# Altium project LM-003.PrjPcb
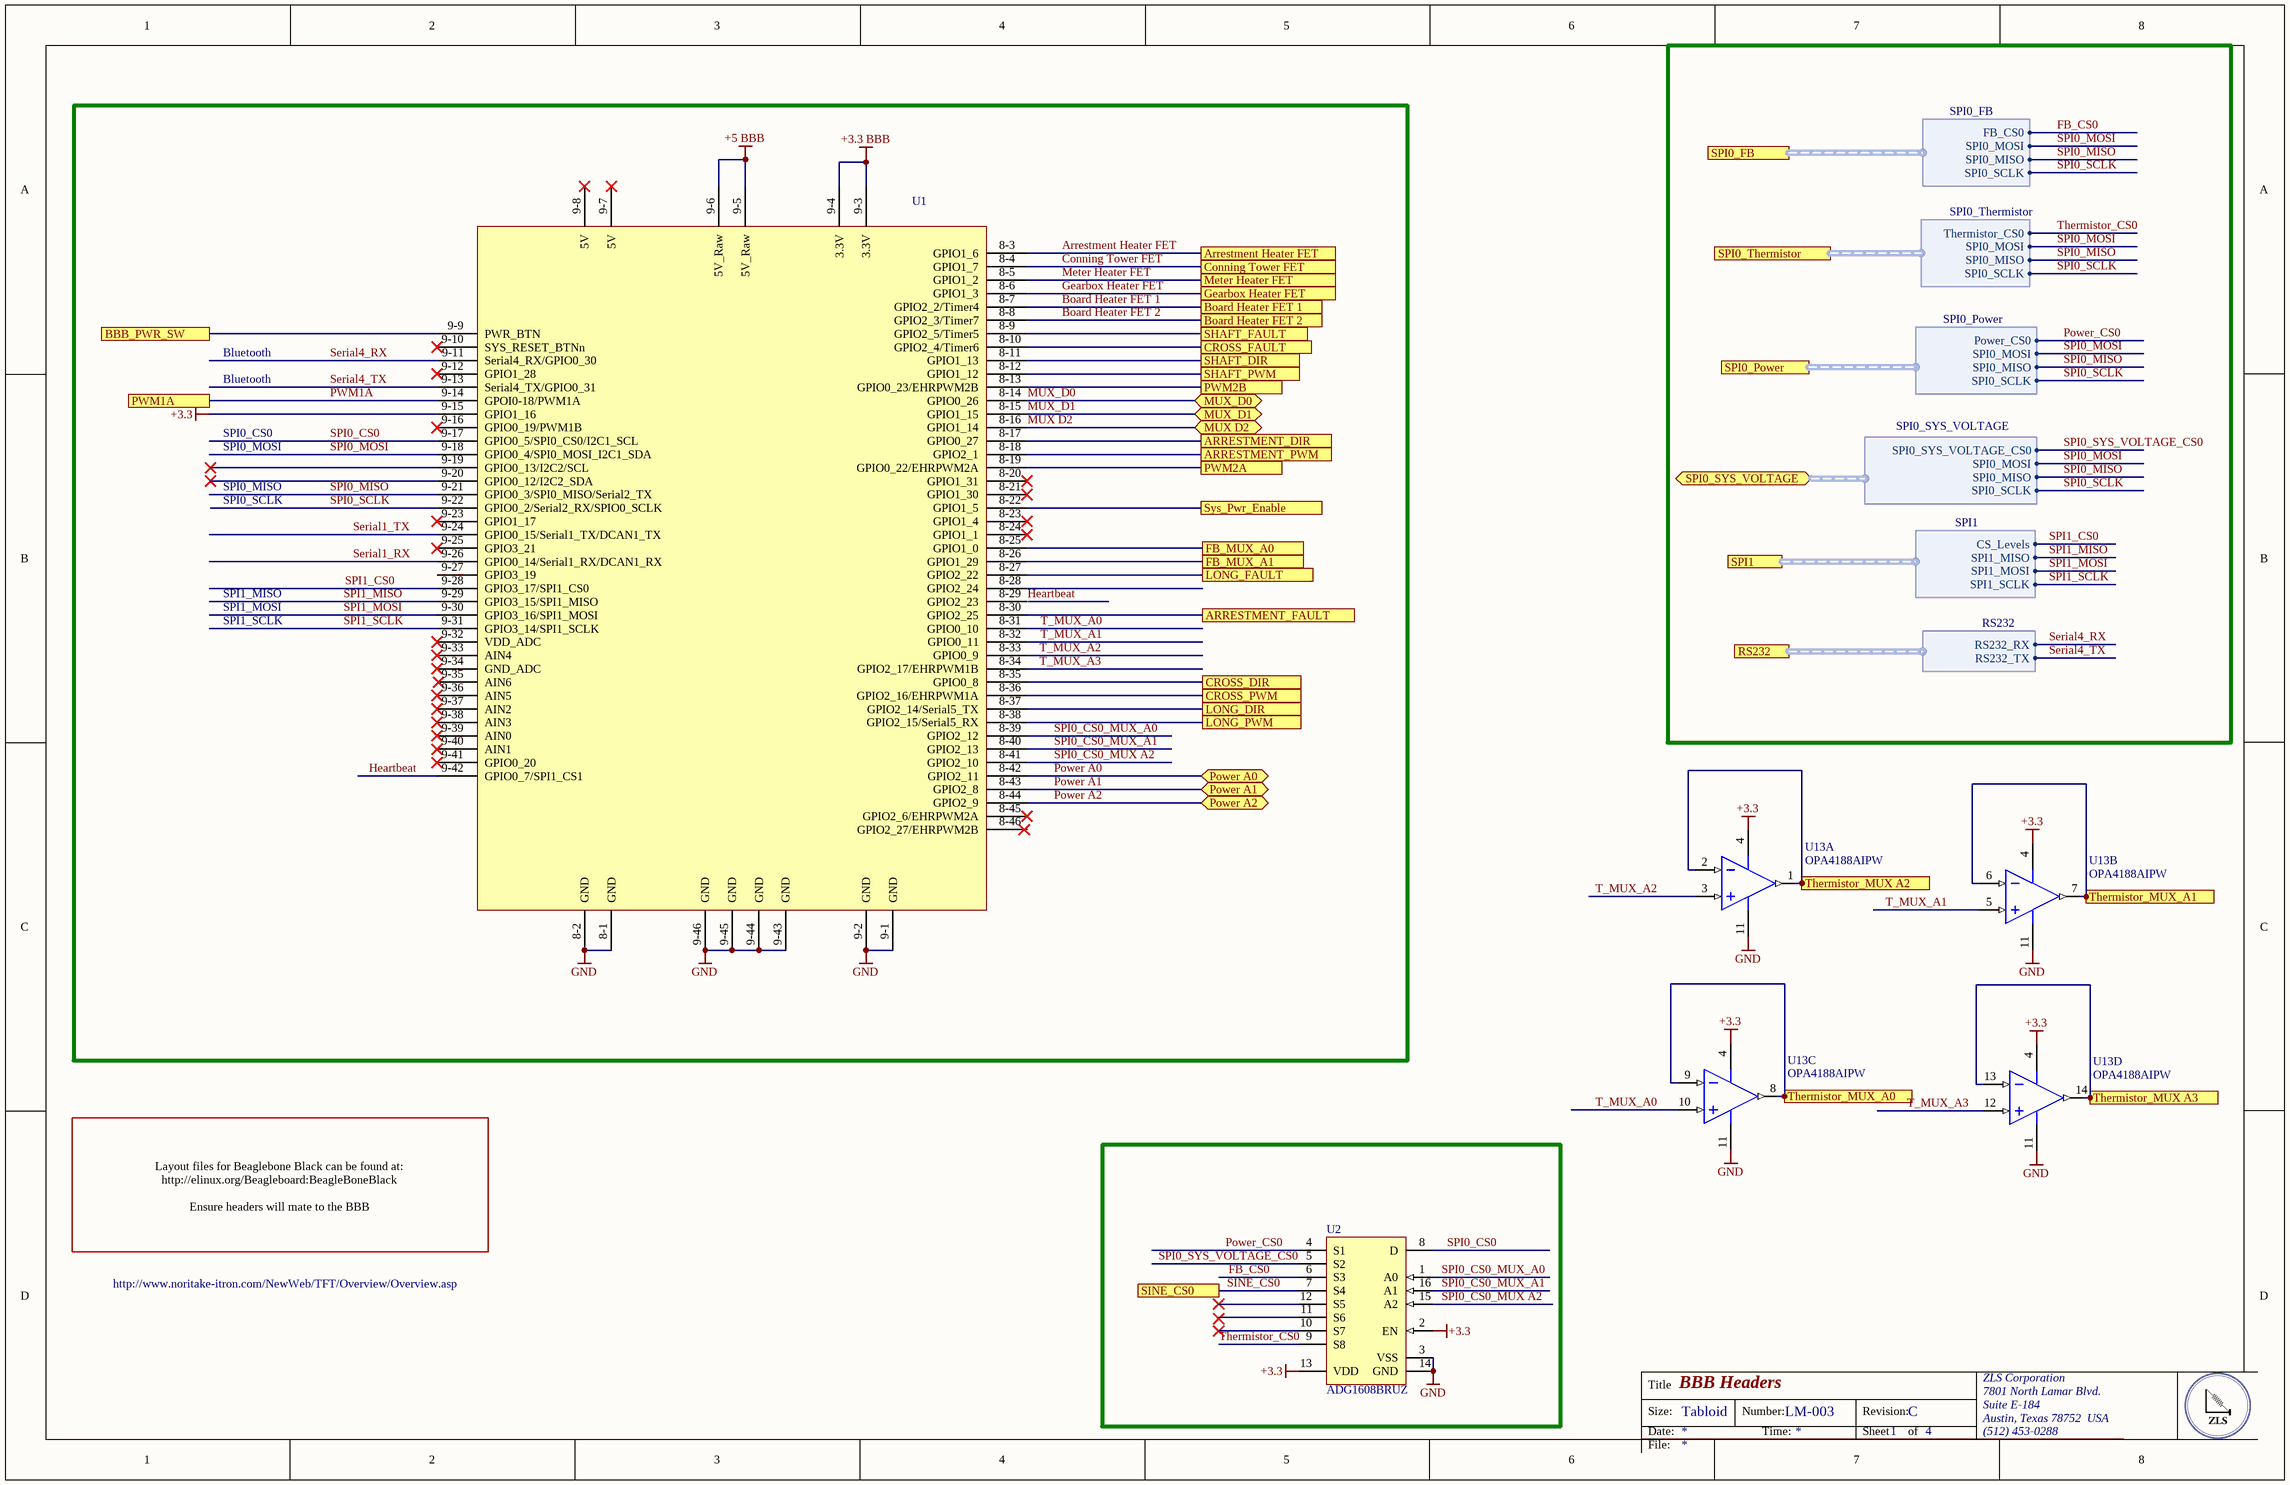
[diagram p0: BBB Headers.SchDoc]
2 sheets, 27 parts. Net scope: flat (ports and power ports of the same name join across sheets).
Board file: LM-003.PcbDoc
Sheets:
  BBB Headers.SchDoc
  ADC.SchDoc

## Sheet BBB Headers.SchDoc: BBB Headers
size Tabloid; DocumentNumber: LM-003; Revision: C; SheetNumber: 1; SheetTotal: 4

### Parts
U1  BBB Header x 2  [Beaglebone Black Thru]  (value not drawn)
U2  ADG1608BRUZ  [ADI-RU-16_M]
U13  OPA4188AIPW  [PW0014A_N]  (parts A,B,C,D of 4)

### Ports
Arrestment Heater FET, ARRESTMENT_DIR, ARRESTMENT_FAULT, ARRESTMENT_PWM, BBB_PWR_SW, Board Heater FET 1, Board Heater FET 2, Conning Tower FET, CROSS_DIR, CROSS_FAULT, CROSS_PWM, FB_MUX_A0, FB_MUX_A1, Gearbox Heater FET, LONG_DIR, LONG_FAULT, LONG_PWM, Meter Heater FET, MUX D2, MUX_D0, MUX_D1, Power A0, Power A1, Power A2, PWM1A, PWM2A, PWM2B, RS232 (harness RS232), SHAFT_DIR, SHAFT_FAULT, SHAFT_PWM, SINE_CS0, SPI0_FB (harness SPI0_FB), SPI0_Power (harness SPI0_Power), SPI0_SYS_VOLTAGE (harness SPI0_SYS_VOLTAGE), SPI0_Thermistor (harness SPI0_Thermistor), SPI1 (harness SPI1), Sys_Pwr_Enable, Thermistor_MUX A2, Thermistor_MUX A3, Thermistor_MUX_A0, Thermistor_MUX_A1

### Harnesses
RS232: RS232_RX, RS232_TX
SPI1: CS_Levels, SPI1_MISO, SPI1_MOSI, SPI1_SCLK
SPI0_Power: Power_CS0, SPI0_MOSI, SPI0_MISO, SPI0_SCLK
SPI0_Thermistor: Thermistor_CS0, SPI0_MOSI, SPI0_MISO, SPI0_SCLK
SPI0_FB: FB_CS0, SPI0_MOSI, SPI0_MISO, SPI0_SCLK
SPI0_SYS_VOLTAGE: SPI0_SYS_VOLTAGE_CS0, SPI0_MOSI, SPI0_MISO, SPI0_SCLK

### Nets
+3.3: U1.9-15(GPIO1_16) U2.2(EN) U2.13(VDD) U13.4(V+)
+3.3 BBB: U1.9-3(3.3V) U1.9-4(3.3V)
+5 BBB: U1.9-5(5V_Raw) U1.9-6(5V_Raw)
GND: U1.8-1(GND) U1.8-2(GND) U1.9-1(GND) U1.9-2(GND) U1.9-43(GND) U1.9-44(GND) U1.9-45(GND) U1.9-46(GND) U2.3(VSS) U2.14(GND) U13.11(V-)
Arrestment Heater FET: U1.8-3(GPIO1_6) ; port Arrestment Heater FET
Board Heater FET 1: U1.8-7(GPIO2_2/Timer4) ; port Board Heater FET 1
Board Heater FET 2: U1.8-8(GPIO2_3/Timer7) ; port Board Heater FET 2
Conning Tower FET: U1.8-4(GPIO1_7) ; port Conning Tower FET
FB_CS0: U2.6(S3) ; port SPI0_FB.FB_CS0
Gearbox Heater FET: U1.8-6(GPIO1_3) ; port Gearbox Heater FET
Heartbeat: U1.8-29(GPIO2_23) U1.9-42(GPIO0_7/SPI1_CS1)
Meter Heater FET: U1.8-5(GPIO1_2) ; port Meter Heater FET
MUX D2: U1.8-16(GPIO1_14) ; port MUX D2
MUX_D0: U1.8-14(GPIO0_26) ; port MUX_D0
MUX_D1: U1.8-15(GPIO1_15) ; port MUX_D1
Power A0: U1.8-42(GPIO2_11) ; port Power A0
Power A1: U1.8-43(GPIO2_8) ; port Power A1
Power A2: U1.8-44(GPIO2_9) ; port Power A2
Power_CS0: U2.4(S1) ; port SPI0_Power.Power_CS0
PWM1A: U1.9-14(GPOI0-18/PWM1A) ; port PWM1A
Serial1_RX: U1.9-26(GPIO0_14/Serial1_RX/DCAN1_RX)
Serial1_TX: U1.9-24(GPIO0_15/Serial1_TX/DCAN1_TX)
Serial4_RX: U1.9-11(Serial4_RX/GPIO0_30) ; port RS232.RS232_RX
Serial4_TX: U1.9-13(Serial4_TX/GPIO0_31) ; port RS232.RS232_TX
SINE_CS0: U2.7(S4) ; port SINE_CS0
SPI0_CS0: U1.9-17(GPIO0_5/SPI0_CS0/I2C1_SCL) U2.8(D)
SPI0_CS0_MUX A2: U1.8-41(GPIO2_10) U2.15(A2)
SPI0_CS0_MUX_A0: U1.8-39(GPIO2_12) U2.1(A0)
SPI0_CS0_MUX_A1: U1.8-40(GPIO2_13) U2.16(A1)
SPI0_MISO: U1.9-21(GPIO0_3/SPI0_MISO/Serial2_TX) ; port SPI0_Power.SPI0_MISO, port SPI0_Thermistor.SPI0_MISO, port SPI0_FB.SPI0_MISO, port SPI0_SYS_VOLTAGE.SPI0_MISO
SPI0_MOSI: U1.9-18(GPIO0_4/SPI0_MOSI_I2C1_SDA) ; port SPI0_Power.SPI0_MOSI, port SPI0_Thermistor.SPI0_MOSI, port SPI0_FB.SPI0_MOSI, port SPI0_SYS_VOLTAGE.SPI0_MOSI
SPI0_SCLK: U1.9-22(GPIO0_2/Serial2_RX/SPIO0_SCLK) ; port SPI0_Power.SPI0_SCLK, port SPI0_Thermistor.SPI0_SCLK, port SPI0_FB.SPI0_SCLK, port SPI0_SYS_VOLTAGE.SPI0_SCLK
SPI0_SYS_VOLTAGE_CS0: U2.5(S2) ; port SPI0_SYS_VOLTAGE.SPI0_SYS_VOLTAGE_CS0
SPI1_CS0: U1.9-28(GPIO3_17/SPI1_CS0) ; port SPI1.CS_Levels
SPI1_MISO: U1.9-29(GPIO3_15/SPI1_MISO) ; port SPI1.SPI1_MISO
SPI1_MOSI: U1.9-30(GPIO3_16/SPI1_MOSI) ; port SPI1.SPI1_MOSI
SPI1_SCLK: U1.9-31(GPIO3_14/SPI1_SCLK) ; port SPI1.SPI1_SCLK
T_MUX_A0: U1.8-31(GPIO0_10) U13.10(IN_C+)
T_MUX_A1: U1.8-32(GPIO0_11) U13.5(IN_B+)
T_MUX_A2: U1.8-33(GPIO0_9) U13.3(IN_A+)
T_MUX_A3: U1.8-34(GPIO2_17/EHRPWM1B) U13.12(IN_D+)
Thermistor_CS0: U2.9(S8) ; port SPI0_Thermistor.Thermistor_CS0
NetU1_8-9: U1.8-9(GPIO2_5/Timer5) ; port SHAFT_FAULT
NetU1_8-10: U1.8-10(GPIO2_4/Timer6) ; port CROSS_FAULT
NetU1_8-11: U1.8-11(GPIO1_13) ; port SHAFT_DIR
NetU1_8-12: U1.8-12(GPIO1_12) ; port SHAFT_PWM
NetU1_8-13: U1.8-13(GPIO0_23/EHRPWM2B) ; port PWM2B
NetU1_8-17: U1.8-17(GPIO0_27) ; port ARRESTMENT_DIR
NetU1_8-18: U1.8-18(GPIO2_1) ; port ARRESTMENT_PWM
NetU1_8-19: U1.8-19(GPIO0_22/EHRPWM2A) ; port PWM2A
NetU1_8-22: U1.8-22(GPIO1_5) ; port Sys_Pwr_Enable
NetU1_8-25: U1.8-25(GPIO1_0) ; port FB_MUX_A0
NetU1_8-26: U1.8-26(GPIO1_29) ; port FB_MUX_A1
NetU1_8-27: U1.8-27(GPIO2_22) ; port LONG_FAULT
NetU1_8-30: U1.8-30(GPIO2_25) ; port ARRESTMENT_FAULT
NetU1_8-35: U1.8-35(GPIO0_8) ; port CROSS_DIR
NetU1_8-36: U1.8-36(GPIO2_16/EHRPWM1A) ; port CROSS_PWM
NetU1_8-37: U1.8-37(GPIO2_14/Serial5_TX) ; port LONG_DIR
NetU1_8-38: U1.8-38(GPIO2_15/Serial5_RX) ; port LONG_PWM
NetU1_9-9: U1.9-9(PWR_BTN) ; port BBB_PWR_SW
NetU13_1: U13.1(OUT_A) U13.2(IN_A-) ; port Thermistor_MUX A2
NetU13_6: U13.6(IN_B-) U13.7(OUT_B) ; port Thermistor_MUX_A1
NetU13_8: U13.8(OUT_C) U13.9(IN_C-) ; port Thermistor_MUX_A0
NetU13_13: U13.13(IN_D-) U13.14(OUT_D) ; port Thermistor_MUX A3

Not connected (* = marked no-connect by the designer): U1 8-20(GPIO1_31)* 8-21(GPIO1_30)* 8-23(GPIO1_4)* 8-24(GPIO1_1)* 8-28(GPIO2_24) 8-45(GPIO2_6/EHRPWM2A)* 8-46(GPIO2_27/EHRPWM2B) 9-7(5V)* 9-8(5V)* 9-10(SYS_RESET_BTNn)* 9-12(GPIO1_28)* 9-16(GPIO0_19/PWM1B)* 9-19(GPIO0_13/I2C2/SCL)* 9-20(GPIO0_12/I2C2_SDA)* 9-23(GPIO1_17)* 9-25(GPIO3_21)* 9-27(GPIO3_19) 9-32(VDD_ADC)* 9-33(AIN4)* 9-34(GND_ADC)* 9-35(AIN6) 9-36(AIN5)* 9-37(AIN2)* 9-38(AIN3)* 9-39(AIN0)* 9-40(AIN1)* 9-41(GPIO0_20)*; U2 10(S7)* 11(S6) 12(S5)*

### Notes on the sheet
- Bluetooth
- SPI0_CS0
- SPI0_MISO
- SPI0_MOSI
- SPI0_SCLK
- SPI1_MISO
- SPI1_SCLK
- SPI1_MOSI
- Layout files for Beaglebone Black can be found at:
  http://elinux.org/Beagleboard:BeagleBoneBlack
  Ensure headers will mate to the BBB
- http://www.noritake-itron.com/NewWeb/TFT/Overview/Overview.asp
- Title
- Size:
- Date:
- Tabloid
- Number:
- Time:
- Revision:
- Sheet
- of
- ZLS Corporation
- 7801 North Lamar Blvd.
- Suite E-184
- Austin, Texas 78752  USA
- (512) 453-0288
- File:

### Library data of the parts
U1 = Beaglebone_Black: Beaglebone Black Header; Manufacturer: Samtec Inc.; Manufacturer Part Number: SSW-123-03-G-D; Connector Type: Receptacle; Style: Board to Board or Cable; Number of Positions: 46; Number of Positions Loaded: All; Pitch - Mating: 0.100" (2.54mm); Contact Length - Post: 0.394" (10.00mm); Material Flammability Rating: UL94 V-0; Current Rating: 5.7A per Contact; Supplier 1: Digi-Key; Supplier Part Number 1: SSW-123-03-G-D-ND; RoHS: RoHS Compliant; Category: Connectors, Interconnects; Stock 1: 0; Pricing 1: 1=6.51 (USD); Packaging: Bulk; Part Status: Active; Contact Type: Forked; Row Spacing - Mating: 0.100" (2.54mm); Mounting Type: Through Hole; Termination: Solder; Fastening Type: Push-Pull; Contact Finish - Mating: Gold; Contact Finish Thickness - Mating: 20.0µin (0.51µm); Insulation Color: Black; Insulation Height: 0.335" (8.51mm); Operating Temperature: -55°C ~ 125°C; Contact Finish - Post: Gold; Mated Stacking Heights: -; Ingress Protection: -; Features: -; Voltage Rating: -; Applications: -; Insulation Material: Liquid Crystal Polymer (LCP); Contact Shape: Square; Contact Material: Phosphor Bronze; Contact Finish Thickness - Post: 3.00µin (0.076µm)
U2 = CMP-0793-00136-1: 4.5 Ohm Ron, 8-Channel +/-5 V,+12 V, +5 V and +3.3 V Multiplexer, 16-pin SOP (RU-16), Tube; Manufacturer: Analog Devices Inc.; Multiplexer/Demultiplexer Circuit: 8:1; On-State Resistance (Max): 4.5 Ohm; Channel-to-Channel Matching (&Delta;Ron): 120 mOhm; Voltage - Supply, Single (V+): 3.3 V ~ 16 V; Voltage - Supply, Dual (V±): ±3.3 V ~ 8 V; Switch Time (Ton, Toff) (Max): 94ns, 93ns; -3db Bandwidth: 40MHz; Charge Injection: 29pC; Channel Capacitance (CS(off), CD(off)): 19pF, 117pF; Current - Leakage (IS(off)) (Max): 100pA; Crosstalk: -64dB @ 1MHz; Supplier 1: Digi-Key; Supplier Part Number 1: ADG1608BRUZ-ND; Manufacturer Part Number: ADG1608BRUZ; RoHS: RoHS Compliant; Category: Integrated Circuits (ICs); Stock 1: 1151; Pricing 1: 1=9.31, 96=8.01552, 192=6.95979, 576=6.0605 (USD); Packaging: Tube; Part Status: Active; Switch Circuit: -; Operating Temperature: -40°C ~ 125°C (TA); Package / Case: 16-TSSOP (0.173", 4.40mm Width); Supplier Device Package: 16-TSSOP; Base Part Number: ADG1608; ComponentLink1URL: http://www.analog.com/media/en/technical-documentation/data-sheets/ADG1608_1609.pdf; ComponentLink1Description: http://www.analog.com/media/en/technical-documentation/data-sheets/ADG1608_1609.pdf
U13 = CMP-0809-00010-2: 0.03 uV/C, Low Noise, Rail-to-Rail Output, Zero-Drift Operational Amplifier, 4 to 36 V, -40 to 125 degC, 14-pin SOP (PW14), Green (RoHS & no Sb/Br); Manufacturer: Texas Instruments; Number of Channels: 4; SubFamily: High Supply Voltage Amplifier (>=30V), Low Noise Amp (<=10nV/rtHz), Low Offset Voltage Amplifier (<=500uV), Low Power Amp (<=500uA), Zero Drift Precision Amplifier; CMRR(Min)(dB): 120; Iq per channel(Max)(mA): 0.475; Offset Drift(Typ)(uV/C): 0.03; Rating: Catalog; GBW(Typ)(MHz): 2; Total Supply Voltage(Max)(+5V is 5, +/-5V is 10): 36; Slew Rate(Typ)(V/us): 0.8; PackageReference: PW0014A; Eco-Plan: Green (RoHS & no Sb/Br); PackageVersion: 4040064-3/G, 02/2011; PartNumber: OPA4188AIPW; Code_JEDEC: MO-153; ComponentLink3URL: http://www.ti.com/litv/pdf/mpds360; ComponentLink1Description: Manufacturer URL; ComponentLink2Description: Datasheet; PackageDescription: 14-Pin Plastic Small Outline, Body 5 x 4.4 mm, Pitch 0.65 mm; Total Supply Voltage(Min)(+5V is 5, +/-5V is 10): 4; ComponentLink1URL: http://www.ti.com/; ComponentLink3Description: Package Specification; DatasheetVersion: SBOS641B; Mounting Technology: Surface Mount; ComponentLink2URL: http://www.ti.com/lit/ds/symlink/opa4188.pdf; PartId: 1

## Sheet ADC.SchDoc: ADC
size OrCAD A; DocumentNumber: LM-003; Revision: C; SheetNumber: 4; SheetTotal: 4
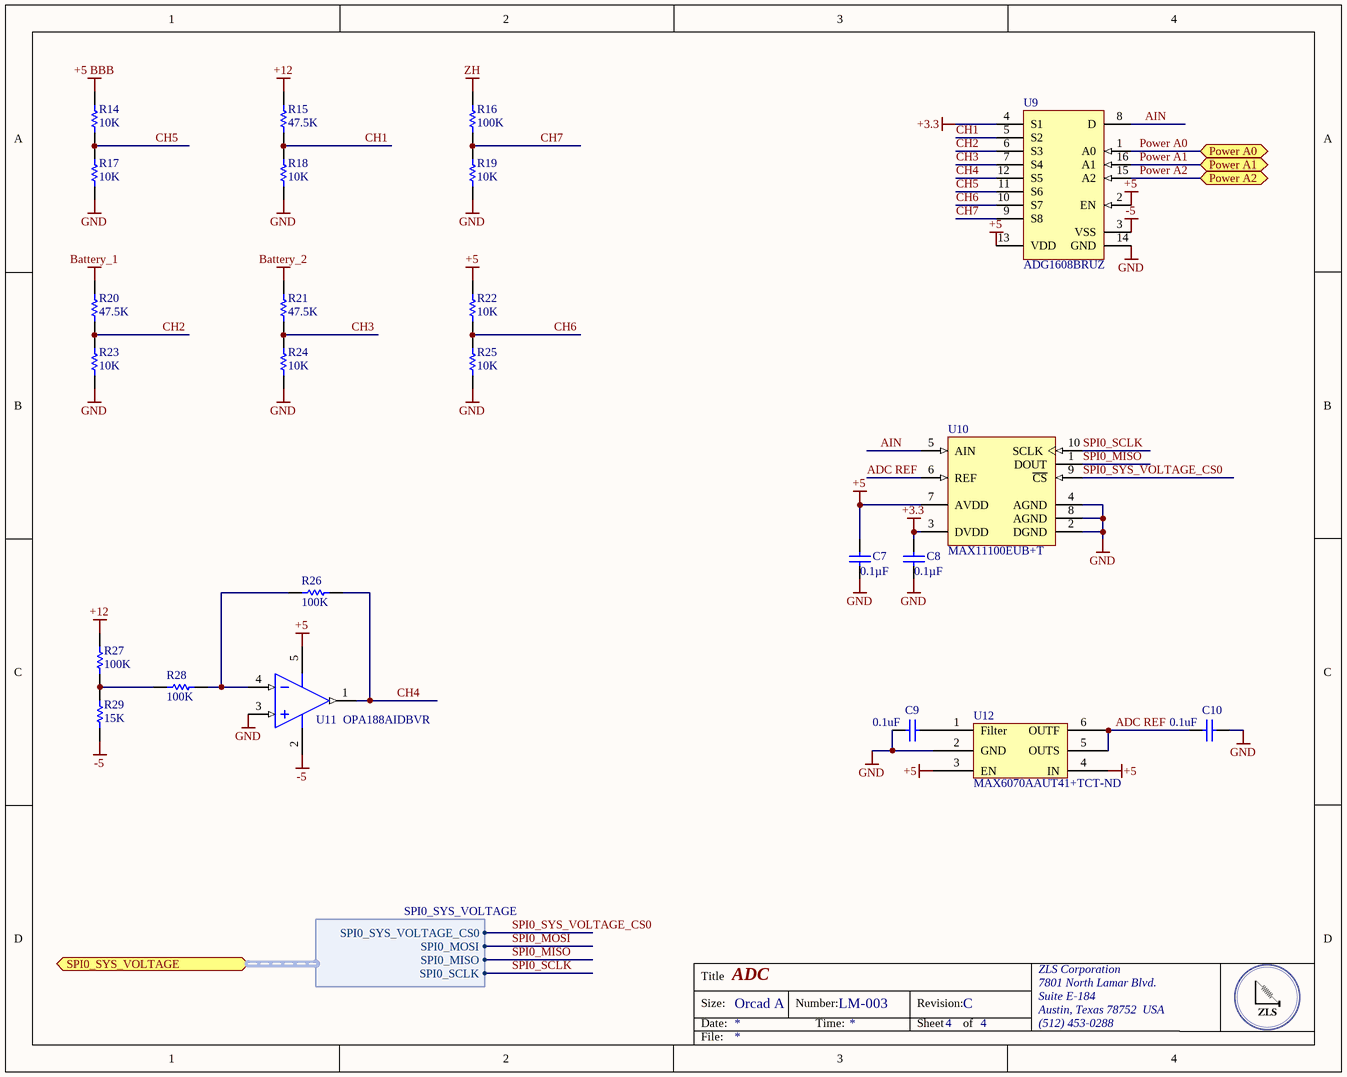
[diagram p1: ADC.SchDoc]

### Parts
C7  Capacitance: 0.1µF  [CAPC0805(2012)145_N]  (hidden comment: CAP CER 0.1UF 25V X7R 0805)
C8  Capacitance: 0.1µF  [CAPC0805(2012)145_N]  (hidden comment: CAP CER 0.1UF 25V X7R 0805)
C9  0.1uF  [CAPC0402(1005)60_L]
C10  0.1uF  [CAPC0402(1005)60_L]
R14  10K  [RESC0805(2012)_L]
R15  47.5K  [RESC0805(2012)_L]
R16  100K  [RESC0805(2012)_L]
R17  10K  [RESC0805(2012)_L]
R18  10K  [RESC0805(2012)_L]
R19  10K  [RESC0805(2012)_L]
R20  47.5K  [RESC0805(2012)_L]
R21  47.5K  [RESC0805(2012)_L]
R22  10K  [RESC0805(2012)_L]
R23  10K  [RESC0805(2012)_L]
R24  10K  [RESC0805(2012)_L]
R25  10K  [RESC0805(2012)_L]
R26  100K  [RESC0805(2012)_L]
R27  100K  [RESC0805(2012)_L]
R28  100K  [RESC0805(2012)_L]
R29  15K  [RESC0805(2012)_L]
U9  ADG1608BRUZ  [ADI-RU-16_M]
U10  MAX11100EUB+T  [U10+2_L]
U11  OPA188AIDBVR  [DBV0005A_M]
U12  Supplier Part Number 1: MAX6070AAUT41+TCT-ND  [SOT95P280X445-6N]  (hidden comment: MAX6070AAUT41+T)

### Ports
Power A0, Power A1, Power A2, SPI0_SYS_VOLTAGE (harness SPI0_SYS_VOLTAGE)

### Harnesses
SPI0_SYS_VOLTAGE: SPI0_SYS_VOLTAGE_CS0, SPI0_MOSI, SPI0_MISO, SPI0_SCLK

### Nets
+3.3: C8.1 U9.4(S1) U10.3(DVDD)
+5: C7.1 R22.1 U9.2(EN) U9.13(VDD) U10.7(AVDD) U11.5(V+) U12.3(EN) U12.4(IN)
+5 BBB: R14.1
+12: R15.1 R27.1
-5: R29.2 U9.3(VSS) U11.2(V-)
Battery_1: R20.1
Battery_2: R21.1
GND: C7.2 C8.2 C9.2 C10.1 R17.2 R18.2 R19.2 R23.2 R24.2 R25.2 U9.14(GND) U10.2(DGND) U10.4(AGND) U10.8(AGND) U11.3(IN+) U12.2(GND)
ZH: R16.1
ADC REF: C10.2 U10.6(REF) U12.5(OUTS) U12.6(OUTF)
AIN: U9.8(D) U10.5(AIN)
CH1: R15.2 R18.1 U9.5(S2)
CH2: R20.2 R23.1 U9.6(S3)
CH3: R21.2 R24.1 U9.7(S4)
CH4: R26.2 U9.12(S5) U11.1(OUT)
CH5: R14.2 R17.1 U9.11(S6)
CH6: R22.2 R25.1 U9.10(S7)
CH7: R16.2 R19.1 U9.9(S8)
Power A0: U9.1(A0) ; port Power A0
Power A1: U9.16(A1) ; port Power A1
Power A2: U9.15(A2) ; port Power A2
SPI0_MISO: U10.1(DOUT) ; port SPI0_SYS_VOLTAGE.SPI0_MISO
SPI0_SCLK: U10.10(SCLK) ; port SPI0_SYS_VOLTAGE.SPI0_SCLK
SPI0_SYS_VOLTAGE_CS0: U10.9(~{CS}) ; port SPI0_SYS_VOLTAGE.SPI0_SYS_VOLTAGE_CS0
NetC9_1: C9.1 U12.1(Filter)
NetR26_1: R26.1 R28.2 U11.4(IN-)
NetR27_2: R27.2 R28.1 R29.1

### Notes on the sheet
- Title
- Size:
- Date:
- Orcad A
- Number:
- Time:
- Revision:
- Sheet
- of
- ZLS Corporation
- 7801 North Lamar Blvd.
- Suite E-184
- Austin, Texas 78752  USA
- (512) 453-0288
- File:

### Library data of the parts
C7 C8 = CMP-1036-04795-1: Manufacturer: Murata Electronics North America; Manufacturer Part Number: GRM21BR71E104KA01L; Tolerance: ±10%; Supplier 1: Digi-Key; Supplier Part Number 1: 490-1673-6-ND; RoHS: RoHS Compliant; Category: Capacitors; Stock 1: 891652; Pricing 1: 1=0.2, 10=0.145, 100=0.0683, 500=0.04788, 1000=0.03964 (USD); Packaging: Digi-Reel®; Part Status: Active; Voltage - Rated: 25V; Temperature Coefficient: X7R; Operating Temperature: -55°C ~ 125°C; Features: -; Ratings: -; Applications: General Purpose; Mounting Type: Surface Mount, MLCC; Package / Case: 0805 (2012 Metric); Size / Dimension: 0.079" L x 0.049" W (2.00mm x 1.25mm); Height - Seated (Max): -; Thickness (Max): 0.053" (1.35mm); Lead Spacing: -; Lead Style: -; ComponentLink1URL: http://www.murata.com/~/media/webrenewal/support/library/catalog/products/capacitor/mlcc/c02e.ashx; ComponentLink1Description: http://www.murata.com/~/media/webrenewal/support/library/catalog/products/capacitor/mlcc/c02e.ashx
C9 C10 = CMP-1034-00252-1: CAP CER 0.1UF 10V X7R 0402; Manufacturer: Murata Electronics North America; Manufacturer Part Number: GRM155R71A104KA01D; Tolerance: ±10%; Supplier 1: Digi-Key; Supplier Part Number 1: 490-6321-1-ND; RoHS: RoHS Compliant; Category: Capacitors; Stock 1: 2920395; Pricing 1: 1=0.1, 10=0.014, 100=0.0063, 500=0.00446, 1000=0.00351, 2500=0.00319, 5000=0.00293 (USD); Packaging: Cut Tape (CT); Part Status: Active; Voltage - Rated: 10V; Temperature Coefficient: X7R; Operating Temperature: -55°C ~ 125°C; Features: -; Ratings: -; Applications: General Purpose; Mounting Type: Surface Mount, MLCC; Package / Case: 0402 (1005 Metric); Size / Dimension: 0.039" L x 0.020" W (1.00mm x 0.50mm); Height - Seated (Max): -; Thickness (Max): 0.022" (0.55mm); Lead Spacing: -; ComponentLink1URL: http://www.murata.com/~/media/webrenewal/support/library/catalog/products/capacitor/mlcc/c02e.ashx?la=en-us; ComponentLink1Description: http://www.murata.com/~/media/webrenewal/support/library/catalog/products/capacitor/mlcc/c02e.ashx?la=en-us
R14 R17-R19 R22-R25 = CMP-1013-00215-1: RES SMD 10K OHM 1% 1/8W 0805; Manufacturer: Yageo; Manufacturer Part Number: AT0603FRE0710KL; Description: RES SMD 10K OHM 1% 1/10W 0603; Power (Watts): 0.1W, 1/10W; Temperature Coefficient: ±50ppm/°C; Supplier 1: Digi-Key; Supplier Part Number 1: YAG2122CT-ND; RoHS: RoHS Compliant; Category: Resistors; Stock 1: 13100; Pricing 1: 1=0.2, 10=0.17, 100=0.0664, 1000=0.02778, 2500=0.02546 (USD); Packaging: Cut Tape (CT); Part Status: Active; Tolerance: ±1%; Composition: Thin Film; Features: Anti-Sulfur, Automotive AEC-Q200, Moisture Resistant; Operating Temperature: -55°C ~ 155°C; Package / Case: 0603 (1608 Metric); Supplier Device Package: 0603; Size / Dimension: 0.063" L x 0.032" W (1.60mm x 0.80mm); Height - Seated (Max): 0.022" (0.55mm); Failure Rate: -; ComponentLink1URL: http://www.yageo.com/documents/recent/PYu-AT_51_RoHS_L_5.pdf; ComponentLink1Description: http://www.yageo.com/documents/recent/PYu-AT_51_RoHS_L_5.pdf
R15 R20 R21 = CMP-1013-00215-1: RES SMD 47.5K OHM 1% 1/10W 0805; Manufacturer: Yageo; Manufacturer Part Number: RT0603FRE0747K5L; Description: RES SMD 47.5K OHM 1% 1/10W 0603; Power (Watts): 0.1W, 1/10W; Temperature Coefficient: ±50ppm/°C; Supplier 1: Digi-Key; Supplier Part Number 1: YAG5964CT-ND; RoHS: RoHS Compliant; Category: Resistors; Stock 1: 5000; Pricing 1: 1=0.1, 10=0.068, 100=0.0275, 1000=0.01236, 2500=0.01073 (USD); Packaging: Cut Tape (CT); Part Status: Active; Tolerance: ±1%; Composition: Thin Film; Features: -; Operating Temperature: -55°C ~ 155°C; Package / Case: 0603 (1608 Metric); Supplier Device Package: 0603; Size / Dimension: 0.063" L x 0.032" W (1.60mm x 0.80mm); Height - Seated (Max): 0.022" (0.55mm); Failure Rate: -; ComponentLink1URL: http://www.yageo.com/documents/recent/PYu-RT_1-to-0.01_RoHS_L_9.pdf; ComponentLink1Description: http://www.yageo.com/documents/recent/PYu-RT_1-to-0.01_RoHS_L_9.pdf
R16 R26-R28 = CMP-1013-00215-1: RES SMD 100K OHM 1% 1/10W 0805; Manufacturer: Vishay Beyschlag; Manufacturer Part Number: MCS04020C1003FE000; Description: RES SMD 100K OHM 1% 1/10W 0402; Power (Watts): 0.1W, 1/10W; Temperature Coefficient: ±50ppm/°C; Supplier 1: Digi-Key; Supplier Part Number 1: MCS0402-100K-CFCT-ND; RoHS: RoHS Compliant; Category: Resistors; Stock 1: 3521; Pricing 1: 1=0.3, 10=0.254, 100=0.0993, 1000=0.04158, 2500=0.03812, 5000=0.03465 (USD); Packaging: Cut Tape (CT); Part Status: Active; Tolerance: ±1%; Composition: Thin Film; Features: Anti-Sulfur; Operating Temperature: -55°C ~ 155°C; Package / Case: 0402 (1005 Metric); Supplier Device Package: 0402; Size / Dimension: 0.039" L x 0.020" W (1.00mm x 0.50mm); Height - Seated (Max): 0.015" (0.37mm); Failure Rate: -; ComponentLink1URL: http://www.vishay.com/docs/28705/mcx0x0xpro.pdf; ComponentLink1Description: http://www.vishay.com/docs/28705/mcx0x0xpro.pdf
R29 = CMP-1013-00215-1: RES SMD 15K OHM 1% 1/10W 0805; Manufacturer: Vishay Beyschlag; Manufacturer Part Number: MCS04020C1502FE000; Description: RES SMD 15K OHM 1% 1/10W 0402; Power (Watts): 0.1W, 1/10W; Temperature Coefficient: ±50ppm/°C; Supplier 1: Digi-Key; Supplier Part Number 1: 749-1555-1-ND; RoHS: RoHS Compliant; Category: Resistors; Stock 1: 91476; Pricing 1: 1=0.3, 10=0.254, 100=0.0993, 1000=0.04158, 2500=0.03812, 5000=0.03465 (USD); Packaging: Cut Tape (CT); Part Status: Active; Tolerance: ±1%; Composition: Thin Film; Features: Anti-Sulfur; Operating Temperature: -55°C ~ 155°C; Package / Case: 0402 (1005 Metric); Supplier Device Package: 0402; Size / Dimension: 0.039" L x 0.020" W (1.00mm x 0.50mm); Height - Seated (Max): 0.015" (0.37mm); Failure Rate: -; ComponentLink1URL: http://www.vishay.com/docs/28705/mcx0x0xpro.pdf; ComponentLink1Description: http://www.vishay.com/docs/28705/mcx0x0xpro.pdf
U9 = CMP-0793-00136-1: as U2 on sheet BBB Headers; Supplier 1: Digi-Key; Supplier Part Number 1: ADG1608BRUZ-ND; Manufacturer Part Number: ADG1608BRUZ; RoHS: RoHS Compliant; Category: Integrated Circuits (ICs); Stock 1: 1151; Pricing 1: 1=9.31, 96=8.01552, 192=6.95979, 576=6.0605 (USD); Packaging: Tube; Part Status: Active; Switch Circuit: -; Operating Temperature: -40°C ~ 125°C (TA); Package / Case: 16-TSSOP (0.173", 4.40mm Width); Supplier Device Package: 16-TSSOP; Base Part Number: ADG1608; ComponentLink1URL: http://www.analog.com/media/en/technical-documentation/data-sheets/ADG1608_1609.pdf; ComponentLink1Description: http://www.analog.com/media/en/technical-documentation/data-sheets/ADG1608_1609.pdf
U10 = CMP-0249-00017-1: IC ADC 16BIT SRL 200KSPS 10UMAX; Manufacturer: Maxim Integrated; Number of Bits: 16; Sampling Rate (Per Second): 200k; Number of Inputs: 1; Input Type: Single Ended; Data Interface: SPI; Configuration: S/H-ADC; Ratio - S/H:ADC: 1:1; Architecture: SAR; Reference Type: External; Voltage - Supply, Analog: 5V; Voltage - Supply, Digital: 2.7 V ~ 5.25 V; Supplier 1: Digi-Key; Supplier Part Number 1: MAX11100EUB+-ND; Manufacturer Part Number: MAX11100EUB+; RoHS: RoHS Compliant; Category: Integrated Circuits (ICs); Stock 1: 927; Pricing 1: 1=5.98, 10=5.855 (USD); Packaging: Tube; Part Status: Active; Features: -; Operating Temperature: -40°C ~ 85°C; Package / Case: 10-TFSOP, 10-MSOP (0.118", 3.00mm Width); Supplier Device Package: 10-uMAX; Base Part Number: MAX11100; ComponentLink1URL: https://datasheets.maximintegrated.com/en/ds/MAX11100.pdf; ComponentLink1Description: https://datasheets.maximintegrated.com/en/ds/MAX11100.pdf
U11 = CMP-0809-00005-2: Precision, Low Noise, Rail-to-Rail Output, Zero-Drift Operational Amplifier, 4 to 36 V, -40 to 125 degC, 5-pin SOT23 (DBV5), Green (RoHS & no Sb/Br); Manufacturer: Texas Instruments; Slew Rate: 0.8 V/µs; Current - Supply: 450µA; Voltage - Supply, Single/Dual (±): 4 V ~ 36 V, ±2 V ~ 18 V; Supplier 1: Digi-Key; Supplier Part Number 1: 296-40438-1-ND; Manufacturer Part Number: OPA188AIDBVR; RoHS: RoHS Compliant; Category: Integrated Circuits (ICs); Stock 1: 1779; Pricing 1: 1=2.46, 10=2.211, 100=1.7771, 500=1.46002, 1000=1.20974 (USD); Packaging: Cut Tape (CT); Part Status: Active; Amplifier Type: Zero-Drift; Output Type: Rail-to-Rail; Operating Temperature: -40°C ~ 125°C; Mounting Type: Surface Mount; Package / Case: SC-74A, SOT-753; Supplier Device Package: SOT-23-5; ComponentLink1URL: http://www.ti.com/lit/ds/symlink/opa188.pdf; ComponentLink1Description: http://www.ti.com/lit/ds/symlink/opa188.pdf
U12 = MAX6070AAUT41+T: IC VREF SERIES 4.096V SOT23; Manufacturer: Maxim Integrated; Output Type: Fixed; Tolerance: ±0.04%; Temperature Coefficient: 6ppm/°C; Noise - 0.1Hz to 10Hz: 9.6µVp-p; Noise - 10Hz to 10kHz: 9µVrms; Voltage - Input: 4.3 V ~ 5.5 V; Current - Supply: 350µA; Supplier 1: Digi-Key; Manufacturer Part Number: MAX6070AAUT41+T; RoHS: RoHS Compliant; Category: Integrated Circuits (ICs); Stock 1: 2623; Pricing 1: 1=3.41, 10=3.213, 25=2.5704, 50=2.4418, 100=2.2491, 250=2.13344, 500=2.05634 (USD); Packaging: Cut Tape (CT); Part Status: Active; Reference Type: Series; Voltage - Output (Min/Fixed): 4.096V; Operating Temperature: -40°C ~ 125°C (TA); Mounting Type: Surface Mount; Package / Case: SOT-23-6; Supplier Device Package: SOT-23-6; ComponentLink1URL: https://datasheets.maximintegrated.com/en/ds/MAX6070-MAX6071.pdf; ComponentLink1Description: https://datasheets.maximintegrated.com/en/ds/MAX6070-MAX6071.pdf

## Nets that join several sheets
+3.3: BBB Headers (U1.9-15 U2.2 U2.13 U13.4), ADC (C8.1 U9.4 U10.3)
+5 BBB: BBB Headers (U1.9-5 U1.9-6), ADC (R14.1)
GND: BBB Headers (11 pins), ADC (16 pins)
Power A0: BBB Headers (U1.8-42), ADC (U9.1)
Power A1: BBB Headers (U1.8-43), ADC (U9.16)
Power A2: BBB Headers (U1.8-44), ADC (U9.15)
SPI0_MISO: BBB Headers (U1.9-21), ADC (U10.1)
SPI0_SCLK: BBB Headers (U1.9-22), ADC (U10.10)
SPI0_SYS_VOLTAGE_CS0: BBB Headers (U2.5), ADC (U10.9)